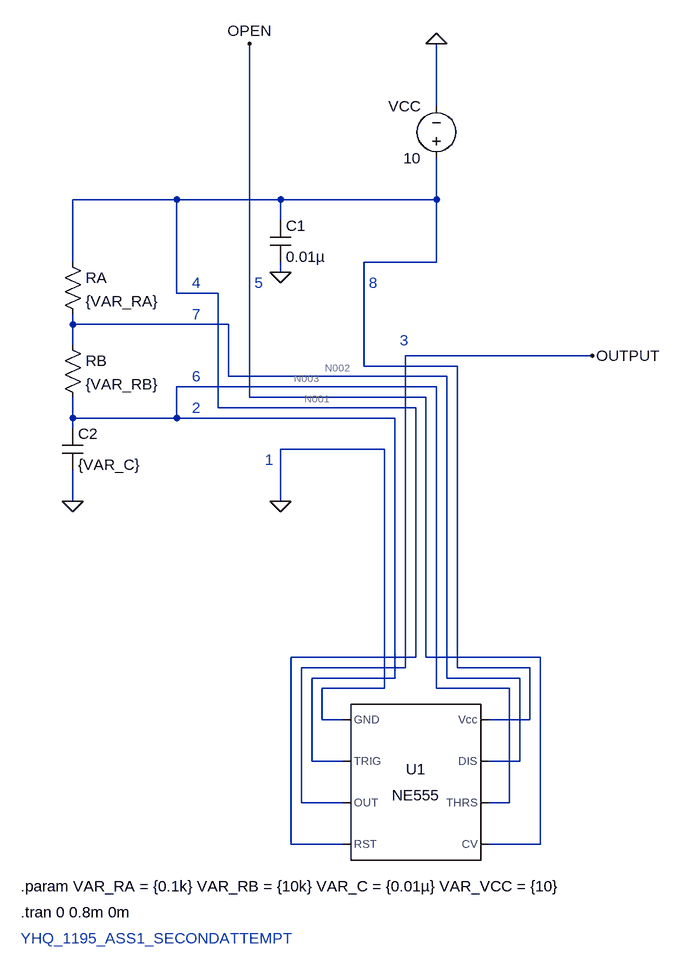
[diagram p0: schematic Draft1.asc]
Draft1.asc, the LTspice schematic file:
Version 4
SHEET 1 1764 1072
WIRE 240 -224 240 -320
WIRE -160 -80 -320 -80
WIRE 0 -80 -160 -80
WIRE 240 -80 240 -144
WIRE 240 -80 0 -80
WIRE 0 -48 0 -80
WIRE -320 16 -320 -80
WIRE 240 16 240 -80
WIRE 240 16 128 16
WIRE 0 32 0 16
WIRE -160 64 -160 -80
WIRE -96 64 -160 64
WIRE -320 112 -320 96
WIRE -80 112 -320 112
WIRE -320 144 -320 112
WIRE 480 160 192 160
WIRE 128 176 128 16
WIRE 272 176 128 176
WIRE -80 192 -80 112
WIRE 256 192 -80 192
WIRE 240 208 -160 208
WIRE -48 224 -48 -320
WIRE 224 224 -48 224
WIRE -96 240 -96 64
WIRE 208 240 -96 240
WIRE -320 256 -320 224
WIRE -160 256 -160 208
WIRE -160 256 -320 256
WIRE 176 256 -160 256
WIRE -320 272 -320 256
WIRE 160 304 0 304
WIRE -320 384 -320 336
WIRE 0 384 0 304
WIRE 208 624 208 240
WIRE 208 624 16 624
WIRE 224 624 224 224
WIRE 400 624 224 624
WIRE 192 640 192 160
WIRE 192 640 32 640
WIRE 272 640 272 176
WIRE 384 640 272 640
WIRE 176 656 176 256
WIRE 176 656 48 656
WIRE 256 656 256 192
WIRE 368 656 256 656
WIRE 160 672 160 304
WIRE 160 672 64 672
WIRE 240 672 240 208
WIRE 352 672 240 672
WIRE 64 720 64 672
WIRE 96 720 64 720
WIRE 384 720 384 640
WIRE 384 720 320 720
WIRE 48 784 48 656
WIRE 96 784 48 784
WIRE 368 784 368 656
WIRE 368 784 320 784
WIRE 32 848 32 640
WIRE 96 848 32 848
WIRE 352 848 352 672
WIRE 352 848 320 848
WIRE 16 912 16 624
WIRE 96 912 16 912
WIRE 400 912 400 624
WIRE 400 912 320 912
FLAG -320 384 0
FLAG 0 384 0
FLAG 240 -320 0
FLAG 0 32 0
FLAG 480 160 OUTPUT
FLAG -48 -320 OPEN
SYMBOL Misc\\NE555 208 816 R0
SYMATTR InstName U1
SYMBOL res -336 0 R0
SYMATTR InstName RA
SYMATTR Value {VAR_RA}
SYMBOL res -336 128 R0
SYMATTR InstName RB
SYMATTR Value {VAR_RB}
SYMBOL cap -336 272 R0
SYMATTR InstName C2
SYMATTR Value {VAR_C}
SYMBOL cap -16 -48 R0
SYMATTR InstName C1
SYMATTR Value 0.01µ
SYMBOL voltage 240 -128 R180
WINDOW 0 24 96 Left 2
WINDOW 3 24 16 Left 2
WINDOW 123 0 0 Left 0
WINDOW 39 0 0 Left 0
SYMATTR InstName VCC
SYMATTR Value 10
TEXT -136 48 Left 2 ;4
TEXT -136 96 Left 2 ;7
TEXT -136 192 Left 2 ;6
TEXT -136 240 Left 2 ;2
TEXT -40 48 Left 2 ;5
TEXT 136 48 Left 2 ;8
TEXT 184 136 Left 2 ;3
TEXT -24 320 Left 2 ;1
TEXT -400 976 Left 2 !.param VAR_RA = {0.1k} VAR_RB = {10k} VAR_C = {0.01µ} VAR_VCC = {10}
TEXT -400 1016 Left 2 !.tran 0 0.8m 0m
TEXT -400 1056 Left 2 ;YHQ_1195_ASS1_SECONDATTEMPT

The netlist it stands for:
* Draft1.asc
XU1 0 N003 OUTPUT N001 OPEN N003 N002 N001 NE555  ; pins GND TRIG OUT RST CV THRS DIS Vcc
RA N001 N002 {VAR_RA}
RB N002 N003 {VAR_RB}
C2 N003 0 {VAR_C}
C1 N001 0 0.01µ
VCC N001 0 10
* 4
* 7
* 6
* 2
* 5
* 8
* 3
* 1
.param VAR_RA = {0.1k} VAR_RB = {10k} VAR_C = {0.01µ} VAR_VCC = {10}
.tran 0 0.8m 0m
* YHQ_1195_ASS1_SECONDATTEMPT
.lib NE555.sub
.backanno
.end

* Results of the author's LTspice run, read from the files saved beside the schematic
* Operating Point, zero values left out:
*   V(n003) = 10 V
*   V(open) = 6.667 V
*   V(n001) = 10 V
*   V(n002) = 10 V
*   V(output) = 10 V
*   I(Rb) = 20 nA
*   I(Ra) = 33.34 nA
*   I(Vcc) = -3.233 mA
*   Ix(u1:1) = -3.233 mA
*   Ix(u1:2) = 10 nA
*   Ix(u1:4) = 56 µA
*   Ix(u1:6) = 10 nA
*   Ix(u1:7) = 13.34 nA
*   Ix(u1:8) = 3.177 mA